# EAGLE design switch-rev2 (EAGLE 6.2)
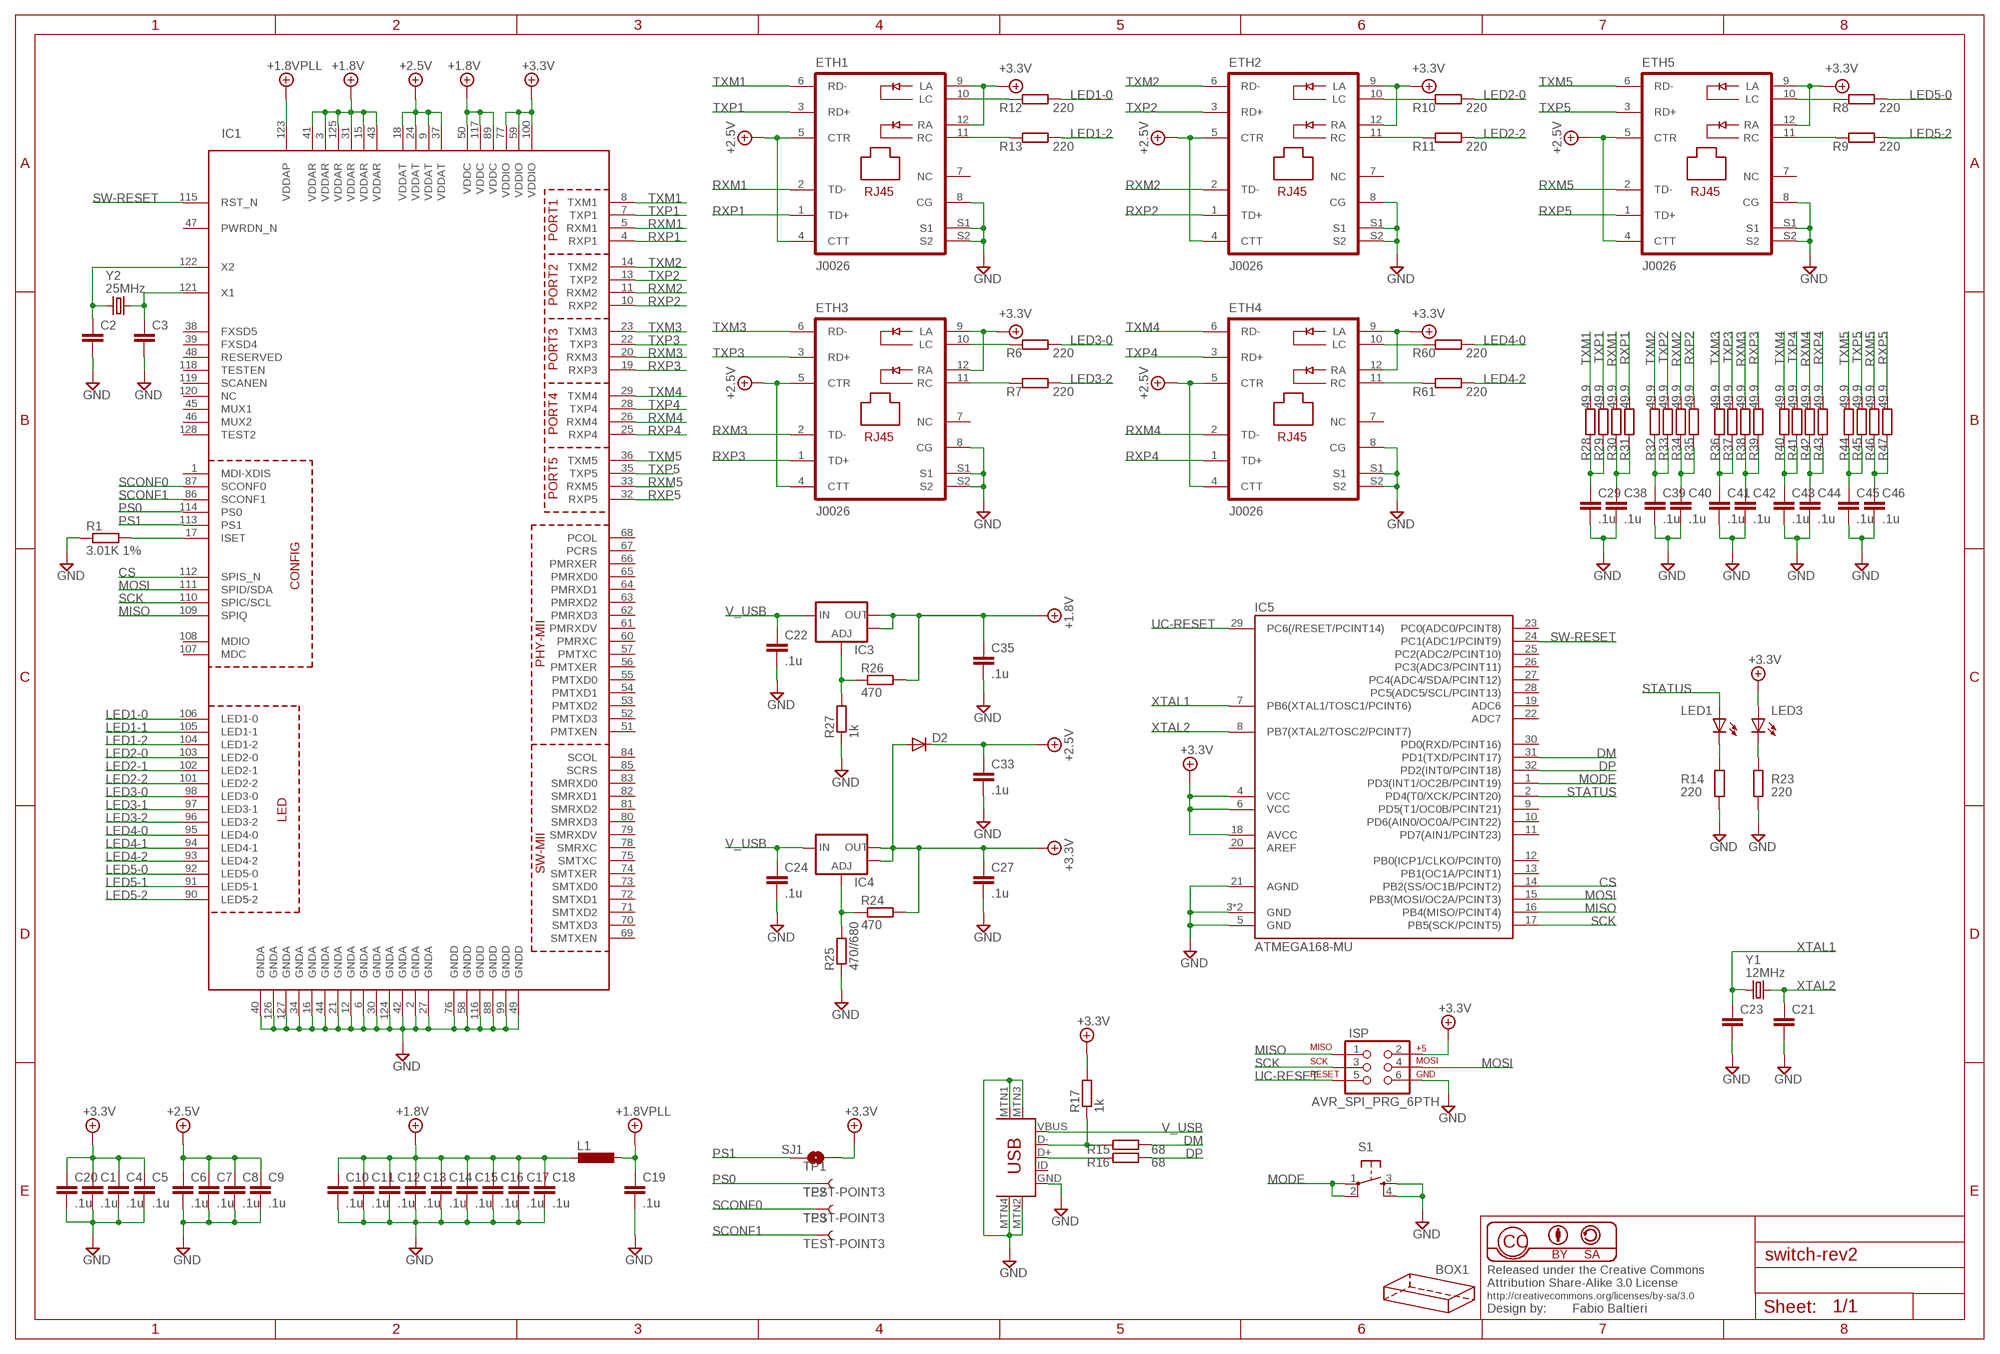
[diagram p0: schematic, sheet 1]

## Parts
BOX1  HAMMOND-BOX-XXA  [1591XXA]
C1  .1u  C-EUC0805  [C0805]
C2  C-EUC0805  [C0805]
C3  C-EUC0805  [C0805]
C4  .1u  C-EUC0805  [C0805]
C5  .1u  C-EUC0805  [C0805]
C6  .1u  C-EUC0805  [C0805]
C7  .1u  C-EUC0805  [C0805]
C8  .1u  C-EUC0805  [C0805]
C9  .1u  C-EUC0805  [C0805]
C10  .1u  C-EUC0805  [C0805]
C11  .1u  C-EUC0805  [C0805]
C12  .1u  C-EUC0805  [C0805]
C13  .1u  C-EUC0805  [C0805]
C14  .1u  C-EUC0805  [C0805]
C15  .1u  C-EUC0805  [C0805]
C16  .1u  C-EUC0805  [C0805]
C17  .1u  C-EUC0805  [C0805]
C18  .1u  C-EUC0805  [C0805]
C19  .1u  C-EUC0805  [C0805]
C20  .1u  C-EUC0805  [C0805]
C21  C-EUC0805  [C0805]
C22  .1u  C-EUC0805  [C0805]
C23  C-EUC0805  [C0805]
C24  .1u  C-EUC0805  [C0805]
C27  .1u  C-EUC0805  [C0805]
C29  .1u  C-EUC0805  [C0805]
C33  .1u  C-EUC0805  [C0805]
C35  .1u  C-EUC0805  [C0805]
C38  .1u  C-EUC0805  [C0805]
C39  .1u  C-EUC0805  [C0805]
C40  .1u  C-EUC0805  [C0805]
C41  .1u  C-EUC0805  [C0805]
C42  .1u  C-EUC0805  [C0805]
C43  .1u  C-EUC0805  [C0805]
C44  .1u  C-EUC0805  [C0805]
C45  .1u  C-EUC0805  [C0805]
C46  .1u  C-EUC0805  [C0805]
D2  DIODE-SMB  [SMB]
ETH1  J0026  [PJ-J0]
ETH2  J0026  [PJ-J0]
ETH3  J0026  [PJ-J0]
ETH4  J0026  [PJ-J0]
ETH5  J0026  [PJ-J0]
IC1  KS8995MA  [PQFP128L]
IC3  V_REG_LM1117SOT223  [SOT223]
IC4  V_REG_LM1117SOT223  [SOT223]
IC5  ATMEGA168-MU  [MLF32-TH]
ISP  AVR_SPI_PRG_6PTH  [2X3]
L1  L-EUL2012C  [L2012C]
LED1  LEDCHIPLED_0603  [CHIPLED_0603]
LED3  LEDCHIPLED_0603  [CHIPLED_0603]
R1  3.01K 1%  R-EU_R0603  [R0603]
R6  220  R-EU_R0603  [R0603]
R7  220  R-EU_R0603  [R0603]
R8  220  R-EU_R0603  [R0603]
R9  220  R-EU_R0603  [R0603]
R10  220  R-EU_R0603  [R0603]
R11  220  R-EU_R0603  [R0603]
R12  220  R-EU_R0603  [R0603]
R13  220  R-EU_R0603  [R0603]
R14  220  R-EU_R0603  [R0603]
R15  68  R-EU_R0603  [R0603]
R16  68  R-EU_R0603  [R0603]
R17  1k  R-EU_R0603  [R0603]
R23  220  R-EU_R0603  [R0603]
R24  470  R-EU_R0603  [R0603]
R25  470//680  R-EU_R0603  [R0603]
R26  470  R-EU_R0603  [R0603]
R27  1k  R-EU_R0603  [R0603]
R28  49.9  R-EU_R0603  [R0603]
R29  49.9  R-EU_R0603  [R0603]
R30  49.9  R-EU_R0603  [R0603]
R31  49.9  R-EU_R0603  [R0603]
R32  49.9  R-EU_R0603  [R0603]
R33  49.9  R-EU_R0603  [R0603]
R34  49.9  R-EU_R0603  [R0603]
R35  49.9  R-EU_R0603  [R0603]
R36  49.9  R-EU_R0603  [R0603]
R37  49.9  R-EU_R0603  [R0603]
R38  49.9  R-EU_R0603  [R0603]
R39  49.9  R-EU_R0603  [R0603]
R40  49.9  R-EU_R0603  [R0603]
R41  49.9  R-EU_R0603  [R0603]
R42  49.9  R-EU_R0603  [R0603]
R43  49.9  R-EU_R0603  [R0603]
R44  49.9  R-EU_R0603  [R0603]
R45  49.9  R-EU_R0603  [R0603]
R46  49.9  R-EU_R0603  [R0603]
R47  49.9  R-EU_R0603  [R0603]
R60  220  R-EU_R0603  [R0603]
R61  220  R-EU_R0603  [R0603]
S1  TAC_SWITCHSMD  [TACTILE_SWITCH_SMD]
SJ1  SOLDERJUMPERTRACE  [SJ_2S-TRACE]
TP1  TEST-POINT3  [PAD.03X.03]
TP2  TEST-POINT3  [PAD.03X.03]
TP3  TEST-POINT3  [PAD.03X.03]
U$1  USB-MINIB-5PIN  [USB-MINIB]
Y1  12MHz  CRYSTAL5X3  [CRYSTAL-SMD-5X3]
Y2  25MHz  CRYSTAL5X3  [CRYSTAL-SMD-5X3]

## Nets
+5V [Power]: C1.1 C4.1 C5.1 C20.1 C27.1 D2.A ETH1.9(LA) ETH1.12(RA) ETH2.9(LA) ETH2.12(RA) ETH3.9(LA) ETH3.12(RA) ETH4.9(LA) ETH4.12(RA) ETH5.9(LA) ETH5.12(RA) IC1.59(VDDIO) IC1.77(VDDIO) IC1.100(VDDIO) IC4.2(OUT) IC4.4(OUT) IC5.4(VCC) IC5.6(VCC) IC5.18(AVCC) ISP.2 LED3.A R17.2 R24.2 SJ1.2 ; supply symbol labelled +3.3V
+5V/1 [Power]: C6.1 C7.1 C8.1 C9.1 C33.1 D2.C ETH1.4(CTT) ETH1.5(CTR) ETH2.4(CTT) ETH2.5(CTR) ETH3.4(CTT) ETH3.5(CTR) ETH4.4(CTT) ETH4.5(CTR) ETH5.4(CTT) ETH5.5(CTR) IC1.9(VDDAT) IC1.18(VDDAT) IC1.24(VDDAT) IC1.37(VDDAT) ; supply symbol labelled +2.5V
+5V/2 [Power]: C10.1 C11.1 C12.1 C13.1 C14.1 C15.1 C16.1 C17.1 C18.1 C35.1 IC1.3(VDDAR) IC1.15(VDDAR) IC1.31(VDDAR) IC1.41(VDDAR) IC1.43(VDDAR) IC1.50(VDDC) IC1.89(VDDC) IC1.117(VDDC) IC1.125(VDDAR) IC3.2(OUT) IC3.4(OUT) L1.2 R26.2 ; supply symbol labelled +1.8V
+5V/4: C19.1 IC1.123(VDDAP) L1.1 ; supply symbol labelled +1.8VPLL
CS: IC1.112(SPIS_N) IC5.14(PB2(SS/OC1B/PCINT2))
DM: IC5.31(PD1(TXD/PCINT17)) R15.1
DP: IC5.32(PD2(INT0/PCINT18)) R16.1
GND [Power]: C1.2 C2.2 C3.2 C4.2 C5.2 C6.2 C7.2 C8.2 C9.2 C10.2 C11.2 C12.2 C13.2 C14.2 C15.2 C16.2 C17.2 C18.2 C19.2 C20.2 C21.2 C22.2 C23.2 C24.2 C27.2 C29.2 C33.2 C35.2 C38.2 C39.2 C40.2 C41.2 C42.2 C43.2 C44.2 C45.2 C46.2 ETH1.8(CG) ETH1.S1 ETH1.S2 ETH2.8(CG) ETH2.S1 ETH2.S2 ETH3.8(CG) ETH3.S1 ETH3.S2 ETH4.8(CG) ETH4.S1 ETH4.S2 ETH5.8(CG) ETH5.S1 ETH5.S2 IC1.2(GNDA) IC1.6(GNDA) IC1.12(GNDA) IC1.16(GNDA) IC1.21(GNDA) IC1.27(GNDA) IC1.30(GNDA) IC1.34(GNDA) IC1.40(GNDA) IC1.42(GNDA) IC1.44(GNDA) IC1.49(GNDD) IC1.58(GNDD) IC1.76(GNDD) IC1.88(GNDD) IC1.99(GNDD) IC1.116(GNDD) IC1.124(GNDA) IC1.126(GNDA) IC1.127(GNDA) IC5.3(GND) IC5.5(GND) IC5.21(AGND) IC5.TH(GND) ISP.6 R1.1 R14.1 R23.1 R25.1 R27.1 S1.3 S1.4 U$1.GND U$1.MTN1(MTN2) U$1.MTN2(MTN3) U$1.MTN3(MTN1) U$1.MTN4
LED1-0: IC1.106(LED1-0) R12.1
LED1-1: IC1.105(LED1-1)
LED1-2: IC1.104(LED1-2) R13.1
LED2-0: IC1.103(LED2-0) R10.1
LED2-1: IC1.102(LED2-1)
LED2-2: IC1.101(LED2-2) R11.1
LED3-0: IC1.98(LED3-0) R6.1
LED3-1: IC1.97(LED3-1)
LED3-2: IC1.96(LED3-2) R7.1
LED4-0: IC1.95(LED4-0) R60.1
LED4-1: IC1.94(LED4-1)
LED4-2: IC1.93(LED4-2) R61.1
LED5-0: IC1.92(LED5-0) R8.1
LED5-1: IC1.91(LED5-1)
LED5-2: IC1.90(LED5-2) R9.1
MISO: IC1.109(SPIQ) IC5.16(PB4(MISO/PCINT4)) ISP.1
MODE: IC5.1(PD3(INT1/OC2B/PCINT19)) S1.1 S1.2
MOSI: IC1.111(SPID/SDA) IC5.15(PB3(MOSI/OC2A/PCINT3)) ISP.4
N$1: IC1.17(ISET) R1.2
N$2: C2.1 IC1.122(X2) Y2.1
N$4: C3.1 IC1.121(X1) Y2.3
N$5: ETH1.11(RC) R13.2
N$9: ETH3.10(LC) R6.2
N$10: ETH3.11(RC) R7.2
N$11: ETH5.10(LC) R8.2
N$12: ETH5.11(RC) R9.2
N$13: ETH2.10(LC) R10.2
N$14: ETH1.10(LC) R12.2
N$15: ETH2.11(RC) R11.2
N$16: LED1.C R14.2
N$17: R15.2 R17.1 U$1.D-
N$18: R16.2 U$1.D+
N$25: LED3.C R23.2
N$47: IC4.1(ADJ) R24.1 R25.2
N$48: IC3.1(ADJ) R26.1 R27.2
N$51: C29.1 R28.1 R29.1
N$53: C38.1 R30.1 R31.1
N$54: C39.1 R32.1 R33.1
N$55: C40.1 R34.1 R35.1
N$56: C41.1 R36.1 R37.1
N$57: C42.1 R38.1 R39.1
N$58: C43.1 R40.1 R41.1
N$59: C44.1 R42.1 R43.1
N$60: C45.1 R44.1 R45.1
N$61: C46.1 R46.1 R47.1
N$68: ETH4.10(LC) R60.2
N$69: ETH4.11(RC) R61.2
PS0: IC1.114(PS0) TP1.P$1
PS1: IC1.113(PS1) SJ1.1
RXM1: ETH1.2(TD-) IC1.5(RXM1) R30.2
RXM2: ETH2.2(TD-) IC1.11(RXM2) R34.2
RXM3: ETH3.2(TD-) IC1.20(RXM3) R38.2
RXM4: ETH4.2(TD-) IC1.26(RXM4) R42.2
RXM5: ETH5.2(TD-) IC1.33(RXM5) R46.2
RXP1: ETH1.1(TD+) IC1.4(RXP1) R31.2
RXP2: ETH2.1(TD+) IC1.10(RXP2) R35.2
RXP3: ETH3.1(TD+) IC1.19(RXP3) R39.2
RXP4: ETH4.1(TD+) IC1.25(RXP4) R43.2
RXP5: ETH5.1(TD+) IC1.32(RXP5) R47.2
SCK: IC1.110(SPIC/SCL) IC5.17(PB5(SCK/PCINT5)) ISP.3
SCONF0: IC1.87(SCONF0) TP2.P$1
SCONF1: IC1.86(SCONF1) TP3.P$1
STATUS: IC5.2(PD4(T0/XCK/PCINT20)) LED1.A
SW-RESET: IC1.115(RST_N) IC5.24(PC1(ADC1/PCINT9))
TXM1: ETH1.6(RD-) IC1.8(TXM1) R28.2
TXM2: ETH2.6(RD-) IC1.14(TXM2) R32.2
TXM3: ETH3.6(RD-) IC1.23(TXM3) R36.2
TXM4: ETH4.6(RD-) IC1.29(TXM4) R40.2
TXM5: ETH5.6(RD-) IC1.36(TXM5) R44.2
TXP1: ETH1.3(RD+) IC1.7(TXP1) R29.2
TXP2: ETH2.3(RD+) IC1.13(TXP2) R33.2
TXP3: ETH3.3(RD+) IC1.22(TXP3) R37.2
TXP4: ETH4.3(RD+) IC1.28(TXP4) R41.2
TXP5: ETH5.3(RD+) IC1.35(TXP5) R45.2
UC-RESET: IC5.29(PC6(/RESET/PCINT14)) ISP.5
V_USB: C22.1 C24.1 IC3.3(IN) IC4.3(IN) U$1.VBUS
XTAL1: C23.1 IC5.7(PB6(XTAL1/TOSC1/PCINT6)) Y1.1
XTAL2: C21.1 IC5.8(PB7(XTAL2/TOSC2/PCINT7)) Y1.3
Unconnected: ETH1.7(NC) ETH2.7(NC) ETH3.7(NC) ETH4.7(NC) ETH5.7(NC) IC1.1(MDI-XDIS) IC1.38(FXSD5) IC1.39(FXSD4) IC1.45(MUX1) IC1.46(MUX2) IC1.47(PWRDN_N) IC1.48(RESERVED) IC1.51(PMTXEN) IC1.52(PMTXD3) IC1.53(PMTXD2) IC1.54(PMTXD1) IC1.55(PMTXD0) IC1.56(PMTXER) IC1.57(PMTXC) IC1.60(PMRXC) IC1.61(PMRXDV) IC1.62(PMRXD3) IC1.63(PMRXD2) IC1.64(PMRXD1) IC1.65(PMRXD0) IC1.66(PMRXER) IC1.67(PCRS) IC1.68(PCOL) IC1.69(SMTXEN) IC1.70(SMTXD3) IC1.71(SMTXD2) IC1.72(SMTXD1) IC1.73(SMTXD0) IC1.74(SMTXER) IC1.75(SMTXC) IC1.78(SMRXC) IC1.79(SMRXDV) IC1.80(SMRXD3) IC1.81(SMRXD2) IC1.82(SMRXD1) IC1.83(SMRXD0) IC1.84(SCOL) IC1.85(SCRS) IC1.107(MDC) IC1.108(MDIO) IC1.118(TESTEN) IC1.119(SCANEN) IC1.120(NC) IC1.128(TEST2) IC5.9(PD5(T1/OC0B/PCINT21)) IC5.10(PD6(AIN0/OC0A/PCINT22)) IC5.11(PD7(AIN1/PCINT23)) IC5.12(PB0(ICP1/CLKO/PCINT0)) IC5.13(PB1(OC1A/PCINT1)) IC5.19(ADC6) IC5.20(AREF) IC5.22(ADC7) IC5.23(PC0(ADC0/PCINT8)) IC5.25(PC2(ADC2/PCINT10)) IC5.26(PC3(ADC3/PCINT11)) IC5.27(PC4(ADC4/SDA/PCINT12)) IC5.28(PC5(ADC5/SCL/PCINT13)) IC5.30(PD0(RXD/PCINT16)) U$1.ID

## Library data of the parts
BOX1 = hammond:HAMMOND-BOX: Hammond Project boxes Hammond 1551 Transluscent Blue 50x35x20mm 1551GTBU http://www.hammondmfg.com/pdf/1551G.pdf Hammond 1551 Transluscent Blue 50x50x20mm 1551RTBU http://www.hammondmfg.com/pdf/1551R.pdf Hammond 1551 Transluscent Blue 60x35x20mm 1551HTBU http://www.hammondmfg.com/pdf/1551H.pdf Hammond 1551 Transluscent Blue 80x40x20mm 1551KTBU http://www.hammondmfg.com/pdf/1551K.pdf Hammond 1591 Transluscent Blue 100x51x22m m 1591XXATBU http://www.hammondmfg.com/pdf/1591XXA.pdf
C1-C24 C27 C29 C33 C35 C38-C46 = rcl:C-EU: CAPACITOR, European symbol
D2 = diode:DIODE-: DIODE
ETH1-ETH5 = micrel:J0026: RJ45 PulseJack w/LEDs
IC1 = micrel:KS8995MA: 5 Port Managed Ethernet Switch
IC3 IC4 = SparkFun-PowerIC:V_REG_LM1117: Voltage Regulator LM1117 Standard adjustable voltage regulator but in SMD form. Spark Fun Electronics SKU : COM-00595
IC5 = balto:ATMEGA168
ISP = SparkFun:AVR_SPI_PRG_6: AVR ISP 6 Pin This is the reduced ISP connector for AVR programming. Common on Arduino. This footprint will take up less PCB space and can be used with a 10-pin to 6-pin adapter such as SKU: BOB-08508
L1 = rcl:L-EU: INDUCTOR, European symbol
LED1 LED3 = led:LED: LED OSRAM: - CHIPLED LG R971, LG N971, LY N971, LG Q971, LY Q971, LO R971, LY R971 LH N974, LH R974 LS Q976, LO Q976, LY Q976 LO Q996 - Hyper CHIPLED LW Q18S LB Q993, LB Q99A, LB R99A - SideLED LS A670, LO A670, LY A670, LG A670, LP A670 LB A673, LV A673, LT A673, LW A673 LH A674 LY A675 LS A676, LA A676, LO A676, LY A676, LW A676 LS A679, LY A679, LG A679 - Hyper Micro SIDELED® LS Y876, LA Y876, LO Y876, LY Y876 LT Y87S - SmartLED LW L88C, LW L88S LB L89C, LB L89S, LG L890 LS L89K, LO L89K, LY L89K LS L896, LA L896, LO L896, LY L896 - TOPLED LS T670, LO T670, LY T670, LG T670, LP T670 LSG T670, LSP T670, LSY T670, LOP T670, LYG T670 LG T671, LOG T671, LSG T671 LB T673, LV T673, LT T673, LW T673 LH T674 LS T676, LA T676, LO T676, LY T676, LB T676, LH T676, LSB T676, LW T676 LB T67C, LV T67C, LT T67C, LS T67K, LO T67K, LY T67K, LW E67C LS E67B, LA E67B, LO E67B, LY E67B, LB E67C, LV E67C, LT E67C LW T67C LS T679, LY T679, LG T679 LS T770, LO T770, LY T770, LG T770, LP T770 LB T773, LV T773, LT T773, LW T773 LH T774 LS E675, LA E675, LY E675, LS T675 LS T776, LA T776, LO T776, LY T776, LB T776 LHGB T686 LT T68C, LB T68C - Hyper Mini TOPLED® LB M676 - Mini TOPLED Santana® LG M470 LS M47K, LO M47K, LY M47K Source: http://www.osram.convergy.de LUXEON: - LUMILED® LXK2-PW12-R00, LXK2-PW12-S00, LXK2-PW14-U00, LXK2-PW14-V00 LXK2-PM12-R00, LXK2-PM12-S00, LXK2-PM14-U00 LXK2-PE12-Q00, LXK2-PE12-R00, LXK2-PE12-S00, LXK2-PE14-T00, LXK2-PE14-U00 LXK2-PB12-K00, LXK2-PB12-L00, LXK2-PB12-M00, LXK2-PB14-N00, LXK2-PB14-P00, LXK2-PB14-Q00 LXK2-PR12-L00, LXK2-PR12-M00, LXK2-PR14-Q00, LXK2-PR14-R00 LXK2-PD12-Q00, LXK2-PD12-R00, LXK2-PD12-S00 LXK2-PH12-R00, LXK2-PH12-S00 LXK2-PL12-P00, LXK2-PL12-Q00, LXK2-PL12-R00 Source: www.luxeon.com KINGBRIGHT: KA-3528ASYC Source: www.kingbright.com
R1 R6-R17 R23-R47 R60 R61 = rcl:R-EU_: RESISTOR, European symbol
S1 = SparkFun:TAC_SWITCH: Momentary Switch Button commonly used for reset or general input. Spark Fun Electronics SKU : COM-00097
SJ1 = SparkFun-Passives:SOLDERJUMPER: Solder Jumper Standard SMD solder jumper. Used to automate production. Two varients : Normally Open and Normally Closed are the same, but have different paste layers. NC will have a large amount of paste and should jumper during reflow.
TP1-TP3 = SparkFun-Passives:TEST-POINT: Bare copper test points for troubleshooting or ICT
U$1 = SparkFun-Connectors:USB-MINIB: Mini-USB "B" connector with 5th pin broken out. Created new symbol breaking out 5th "ID" pin in mini/micro USB connector spec. See: http://en.wikipedia.org/wiki/Mini_usb#Cables. Uses same footprint as 4-pin symbol. Also added pins to connect to mounting / shield pads if required (probably not generally needed as signals aren't shielded once they leave the connector).
Y1 Y2 = SparkFun-FreqCtrl:CRYSTAL: Various standard crystals. Proven footprints. Spark Fun Electronics SKU : COM-00534

## Board
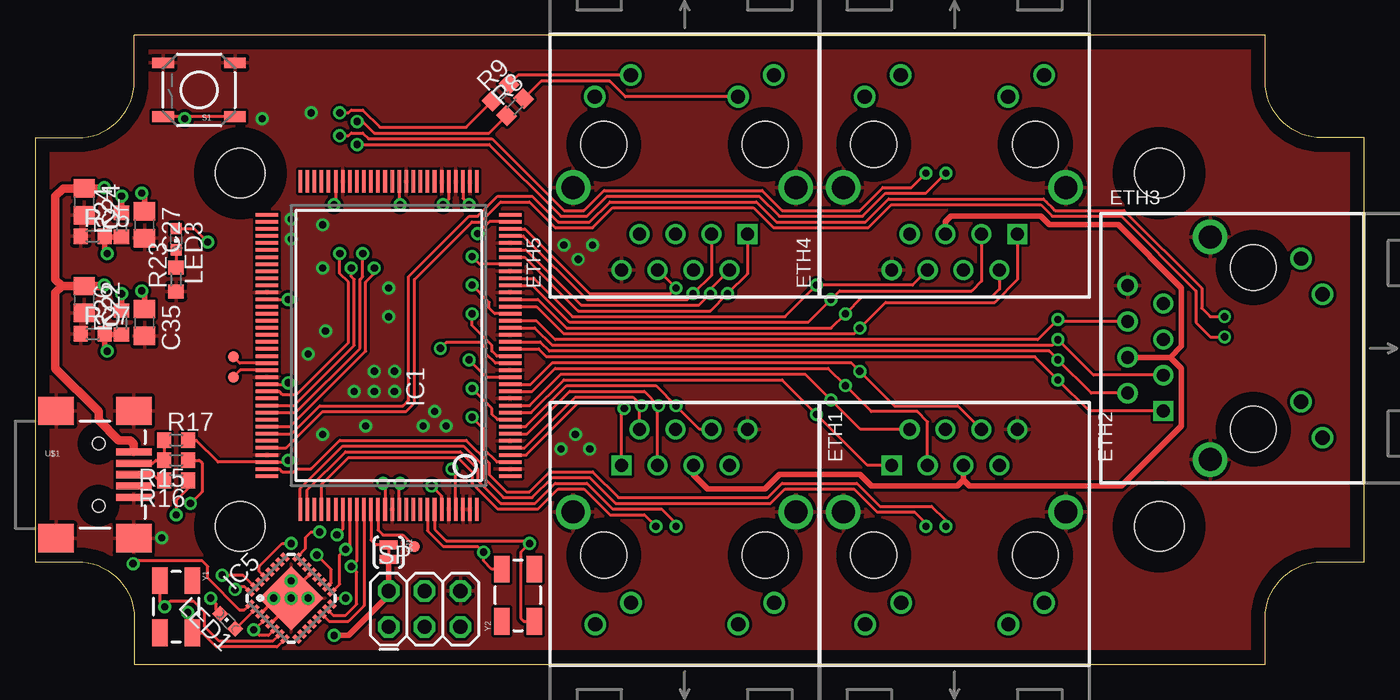
[diagram p1: board, top side]
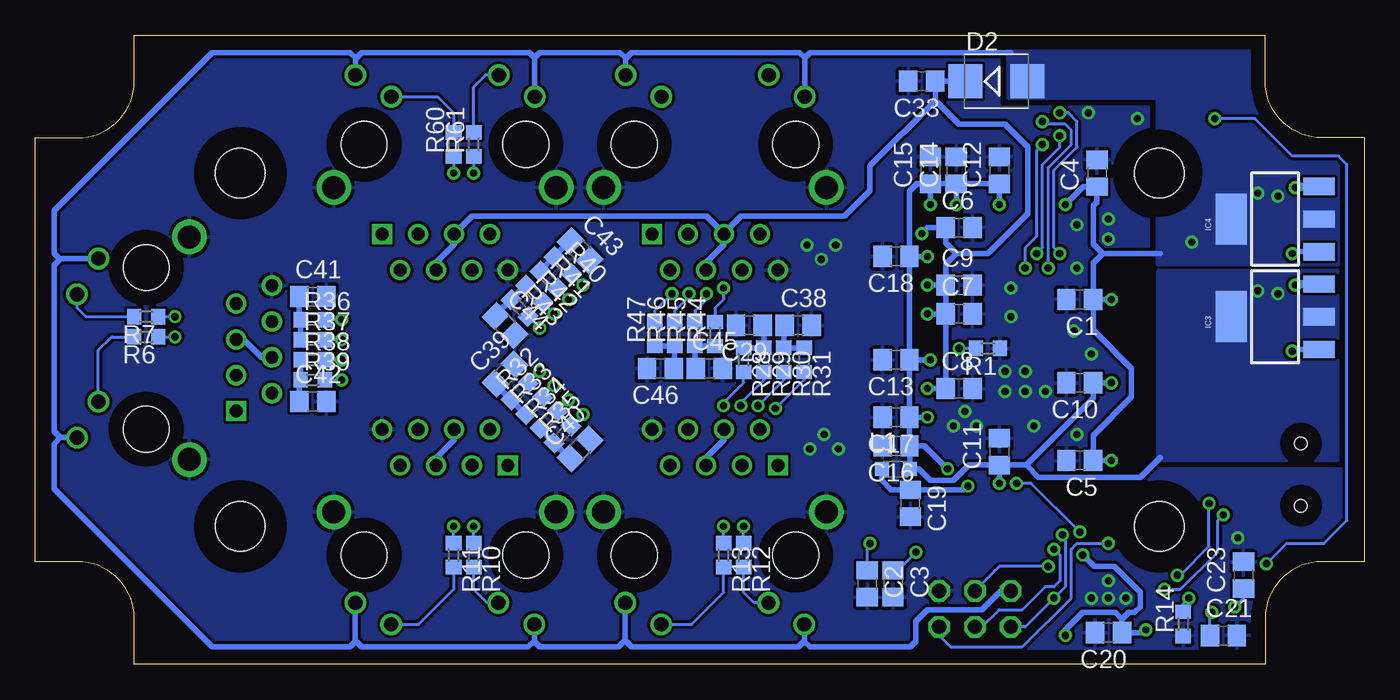
[diagram p2: board, bottom side, seen from below]

Size 94 x 44.5 mm. Coordinates in mm from the lower left corner, seen from the top.
Copper layers (1*16): Top 0.035mm / dielectric 1.5mm / Bottom 0.035mm
Design rules: minimum track width 8mil, minimum drill 20mil, track to track 8mil, track to pad 8mil, pad to pad 8mil, via to via 8mil, smd to smd 8mil, copper to edge 40mil, drill to drill 8mil, minimum pad ring 10mil, minimum via ring 8mil, stop-mask expansion 4mil, vias tented up to drill 24mil, thermal gap 10mil

### Footprints (pad centres in the part's own frame; a part is rotated, then mirrored left to right if it is on the bottom)
1591XXA = hole 3.5: 79.5,9.75; 14.5,34.75; 79.5,34.75; 14.5,9.75
C0805 = smd 1.3 x 1.5: 1 -0.95,0; 2 0.95,0
SMB = smd 2.4 x 2.4: A 2.2,0; C -2.2,0
PJ-J0 = drill 0.914 square: 1 4.445,-6.35 | drill 0.914: 2 3.175,-8.89; 3 1.905,-6.35; 4 0.635,-8.89; 5 -0.635,-6.35; 6 -1.905,-8.89; 7 -3.175,-6.35; 8 -4.445,-8.89 | drill 1.016: 9 6.325,4.902; 10 3.785,3.378; 11 -3.81,4.902; 12 -6.35,3.378 | drill 1.626: S1 -7.874,-3.048; S2 7.874,-3.048 | hole 3.251: -5.715,0; 5.715,0
PQFP128L = smd 0.25 x 1.6: 1 -9.25,-8.6; 2 -8.75,-8.6; 3 -8.25,-8.6; 4 -7.75,-8.6; 5 -7.25,-8.6; 6 -6.75,-8.6; 7 -6.25,-8.6; 8 -5.75,-8.6; 9 -5.25,-8.6; 10 -4.75,-8.6; 11 -4.25,-8.6; 12 -3.75,-8.6; 13 -3.25,-8.6; 14 -2.75,-8.6; 15 -2.25,-8.6; 16 -1.75,-8.6; 17 -1.25,-8.6; 18 -0.75,-8.6; 19 -0.25,-8.6; 20 0.25,-8.6; 21 0.75,-8.6; 22 1.25,-8.6; 23 1.75,-8.6; 24 2.25,-8.6; 25 2.75,-8.6; 26 3.25,-8.6; 27 3.75,-8.6; 28 4.25,-8.6; 29 4.75,-8.6; 30 5.25,-8.6; 31 5.75,-8.6; 32 6.25,-8.6; 33 6.75,-8.6; 34 7.25,-8.6; 35 7.75,-8.6; 36 8.25,-8.6; 37 8.75,-8.6; 38 9.25,-8.6; 65 9.25,8.6; 66 8.75,8.6; 67 8.25,8.6; 68 7.75,8.6; 69 7.25,8.6; 70 6.75,8.6; 71 6.25,8.6; 72 5.75,8.6; 73 5.25,8.6; 74 4.75,8.6; 75 4.25,8.6; 76 3.75,8.6; 77 3.25,8.6; 78 2.75,8.6; 79 2.25,8.6; 80 1.75,8.6; 81 1.25,8.6; 82 0.75,8.6; 83 0.25,8.6; 84 -0.25,8.6; 85 -0.75,8.6; 86 -1.25,8.6; 87 -1.75,8.6; 88 -2.25,8.6; 89 -2.75,8.6; 90 -3.25,8.6; 91 -3.75,8.6; 92 -4.25,8.6; 93 -4.75,8.6; 94 -5.25,8.6; 95 -5.75,8.6; 96 -6.25,8.6; 97 -6.75,8.6; 98 -7.25,8.6; 99 -7.75,8.6; 100 -8.25,8.6; 101 -8.75,8.6; 102 -9.25,8.6 | smd 1.6 x 0.25: 39 11.6,-6.25; 40 11.6,-5.75; 41 11.6,-5.25; 42 11.6,-4.75; 43 11.6,-4.25; 44 11.6,-3.75; 45 11.6,-3.25; 46 11.6,-2.75; 47 11.6,-2.25; 48 11.6,-1.75; 49 11.6,-1.25; 50 11.6,-0.75; 51 11.6,-0.25; 52 11.6,0.25; 53 11.6,0.75; 54 11.6,1.25; 55 11.6,1.75; 56 11.6,2.25; 57 11.6,2.75; 58 11.6,3.25; 59 11.6,3.75; 60 11.6,4.25; 61 11.6,4.75; 62 11.6,5.25; 63 11.6,5.75; 64 11.6,6.25; 103 -11.6,6.25; 104 -11.6,5.75; 105 -11.6,5.25; 106 -11.6,4.75; 107 -11.6,4.25; 108 -11.6,3.75; 109 -11.6,3.25; 110 -11.6,2.75; 111 -11.6,2.25; 112 -11.6,1.75; 113 -11.6,1.25; 114 -11.6,0.75; 115 -11.6,0.25; 116 -11.6,-0.25; 117 -11.6,-0.75; 118 -11.6,-1.25; 119 -11.6,-1.75; 120 -11.6,-2.25; 121 -11.6,-2.75; 122 -11.6,-3.25; 123 -11.6,-3.75; 124 -11.6,-4.25; 125 -11.6,-4.75; 126 -11.6,-5.25; 127 -11.6,-5.75; 128 -11.6,-6.25
SOT223 = smd 1.219 x 2.235: 1 -2.311,-3.099; 2 0,-3.099; 3 2.311,-3.099 | smd 3.6 x 2.2: 4 0,3.099
MLF32-TH = smd 0.65 x 0.29: 1 -2.35,1.75; 2 -2.35,1.25; 3 -2.35,0.75; 4 -2.35,0.25; 5 -2.35,-0.25; 6 -2.35,-0.75; 7 -2.35,-1.25; 8 -2.35,-1.75; 17 2.35,-1.75; 18 2.35,-1.25; 19 2.35,-0.75; 20 2.35,-0.25; 21 2.35,0.25; 22 2.35,0.75; 23 2.35,1.25; 24 2.35,1.75 | smd 0.29 x 0.65: 9 -1.75,-2.35; 10 -1.25,-2.35; 11 -0.75,-2.35; 12 -0.25,-2.35; 13 0.25,-2.35; 14 0.75,-2.35; 15 1.25,-2.35; 16 1.75,-2.35; 25 1.75,2.35; 26 1.25,2.35; 27 0.75,2.35; 28 0.25,2.35; 29 -0.25,2.35; 30 -0.75,2.35; 31 -1.25,2.35; 32 -1.75,2.35 | smd 3.2 x 3.2: TH 0,0
2X3 = drill 1.016 octagon: 1 0,0; 2 0,2.54; 3 2.54,0; 4 2.54,2.54; 5 5.08,0; 6 5.08,2.54
L2012C = smd 1 x 1: 1 -1,0; 2 1,0
CHIPLED_0603 = smd 0.8 x 0.8: A 0,-0.75; C 0,0.75
R0603 = smd 1 x 1.1: 1 -0.85,0; 2 0.85,0
TACTILE_SWITCH_SMD = smd 1.524 x 0.762: 1 -2.54,1.905; 2 2.54,1.905; 3 -2.54,-1.905; 4 2.54,-1.905
SJ_2S-TRACE = smd 0.635 x 1.27: 1 -0.508,0; 2 0.508,0
PAD.03X.03 = smd 0.762 x 0.762: P$1 0,0
USB-MINIB = smd 2.5 x 0.5: D+ 2.5,0; D- 2.5,0.8; GND 2.5,-1.6; ID 2.5,-0.8; VBUS 2.5,1.6 | smd 2.5 x 2: MTN1 -3,4.5; MTN2 2.5,4.5; MTN3 -3,-4.5; MTN4 2.5,-4.5 | hole 0.9: 0,2.2; 0,-2.2
CRYSTAL-SMD-5X3 = smd 1.9 x 1.1: 1 -1.85,-1.15; 2 1.85,-1.15; 3 1.85,1.15; 4 -1.85,1.15

### Placement (x,y rotation side)
BOX1  0,0 0 top
C1  20.12,25.81 180 bottom
C2  35.15,5.69 270 bottom
C3  33.32,5.69 270 bottom
C4  18.9,34.75 90 bottom
C5  20.12,14.43 180 bottom
C6  28.65,30.89 0 bottom
C7  28.65,24.79 0 bottom
C8  28.65,19.51 0 bottom
C9  28.65,26.82 0 bottom
C10  20.12,19.91 180 bottom
C11  25.81,15.04 90 bottom
C12  25.81,34.95 90 bottom
C13  33.12,21.54 180 bottom
C14  28.85,34.95 90 bottom
C15  30.68,34.95 90 bottom
C16  33.12,15.44 180 bottom
C17  33.12,17.48 180 bottom
C18  33.12,28.85 180 bottom
C19  32.11,11.38 270 bottom
C20  18.08,2.24 180 bottom
C21  9.96,2.03 0 bottom
C22  3.45,25.81 270 top
C23  8.53,6.3 90 bottom
C24  3.45,32.72 270 top
C27  7.72,31.09 270 top
C29  43.48,23.98 180 bottom
C33  31.29,41.25 180 bottom
C35  7.72,24.18 270 top
C38  40.03,23.98 0 bottom
C39  60.76,20.52 45 bottom
C40  55.47,15.24 45 bottom
C41  74.37,26.01 0 bottom
C42  74.37,18.59 0 bottom
C43  55.47,29.26 315 bottom
C44  60.76,23.98 315 bottom
C45  46.33,20.93 0 bottom
C46  49.78,20.93 180 bottom
D2  26.01,41.25 0 bottom
ETH1  45.92,7.72 180 top
ETH2  65.02,7.72 180 top
ETH3  86.16,22.35 270 top
ETH4  65.02,36.78 0 top
ETH5  45.92,36.78 0 top
IC1  24.99,22.56 90 top
IC3  6.3,24.59 90 bottom
IC4  6.3,31.5 90 bottom
IC5  18.08,4.67 45 top
ISP  24.99,2.64 0 top
L1  33.12,13.82 0 bottom
LED1  13.61,3.05 45 top
LED3  9.96,30.07 180 top
R1  26.62,22.35 180 bottom
R6  86.16,23.16 180 bottom
R7  86.16,24.59 180 bottom
R8  33.93,39.42 45 top
R9  32.92,40.44 45 top
R10  62.99,7.72 270 bottom
R11  64.41,7.72 270 bottom
R12  43.89,7.72 270 bottom
R13  45.31,7.72 270 bottom
R14  12.8,2.84 90 bottom
R15  9.96,14.43 180 top
R16  9.96,13 180 top
R17  9.96,15.85 0 top
R23  9.96,27.23 90 top
R24  6.1,31.09 90 top
R25  4.06,30.28 0 top
R26  6.1,24.18 90 top
R27  4.06,23.37 0 top
R28  43.89,21.54 270 bottom
R29  42.47,21.54 270 bottom
R30  41.05,21.54 270 bottom
R31  39.62,21.54 270 bottom
R32  59.74,19.3 45 bottom
R33  58.72,18.29 45 bottom
R34  57.71,17.27 45 bottom
R35  56.69,16.26 45 bottom
R36  74.37,24.38 0 bottom
R37  74.37,22.96 0 bottom
R38  74.37,21.54 0 bottom
R39  74.37,20.12 0 bottom
R40  56.69,28.24 315 bottom
R41  57.71,27.23 315 bottom
R42  58.72,26.21 315 bottom
R43  59.74,25.2 315 bottom
R44  45.92,23.37 90 bottom
R45  47.35,23.37 90 bottom
R46  48.77,23.37 90 bottom
R47  50.19,23.37 90 bottom
R60  64.41,36.78 90 bottom
R61  62.99,36.78 90 bottom
S1  11.58,40.64 180 top
SJ1  24.99,7.92 270 top
TP1  26.82,8.33 180 top
TP2  14.02,20.32 180 top
TP3  14.02,21.74 180 top
U$1  4.47,13.41 0 top
Y1  9.96,4.06 270 top
Y2  34.14,4.88 90 top

### Tracks (layer width: path | path; a pad name or v marks a point on that pad's centre or on a via)
+5V  (via drill 0.51)
  Top 0.203: IC5.6 16.5,2.03 15.85,2.03 v15.44,2.44 15.5,2.44 IC5.4 | IC5.18 20.93,5.75 20.93,6.71 v19.91,7.72 | IC1.59 21.24,32.62 v21.13,32.51 | IC1.77 v17.88,25.8 v17.88,25.81 | v17.88,14.43 17.76,14.3 IC1.100 12.92,14.3 11.38,15.85 R17.2 | LED3.A 11.24,30.82 v12.19,29.87
  Top 0.406: R24.2 v6.1,33.12 | C27.1 7.72,33.12 v7.52,33.33 | SJ1.2 ISP.2 24.99,4.88 22.15,2.03 v21.13,2.03
  Bottom 0.203: v12.19,29.87 12.39,29.87
  Bottom 0.406: C1.1 v17.88,25.81 | v17.88,14.43 C5.1 19.17,16.19 16.46,18.9 16.46,20.93 19.17,23.64 C1.1 | C1.1 19.17,28.38 18.49,29.06 | 18.49,29.06 19.17,29.73 19.17,32.45 18.9,32.72 C4.1 19.85,33.8 v21.13,32.51 | 18.49,29.06 14.43,29.06 | ETH5.12 39.57,42.93 | 39.57,42.93 39.22,43.28 24.99,43.28 | 39.57,42.93 39.93,43.28 51.82,43.28 52.25,42.85 | ETH5.9 52.25,42.85 | 52.25,42.85 52.25,42.9 52.63,43.28 58.32,43.28 58.67,42.93 | ETH4.12 58.67,42.93 | 58.67,42.93 59.03,43.28 70.92,43.28 71.32,42.88 | ETH4.9 71.35,42.85 71.32,42.88 | 71.32,42.88 71.73,43.28 81.48,43.28 92.66,32.11 92.66,29.06 92.3,28.7 | ETH3.12 92.3,28.7 | 92.3,28.7 92.3,28.6 92.66,28.25 92.66,16.46 92.23,16.03 | ETH3.9 92.23,16.03 | 92.23,16.03 92.66,15.6 92.66,12.39 81.48,1.22 71.73,1.22 71.37,1.57 | ETH2.12 71.37,1.57 | 71.37,1.57 71.27,1.57 70.92,1.22 59.13,1.22 58.73,1.63 | ETH2.9 58.7,1.65 58.73,1.63 | 58.73,1.63 58.32,1.22 52.73,1.22 52.27,1.68 | ETH1.9 39.6,1.65 | 39.6,1.65 40.03,1.22 51.82,1.22 52.27,1.68 | 39.6,1.65 39.6,1.6 39.22,1.22 32.11,1.22 31.7,1.63 31.7,3.05 30.89,3.86 27.03,3.86 25.7,5.18 ISP.2 | ETH1.12 52.27,1.68 | v19.91,7.72 19.1,6.91 17.68,6.91 15.85,5.08 15.85,4.06 16.26,3.66 16.66,3.66 17.14,3.19 | 17.14,3.19 C20.1 15.65,2.23 v15.44,2.44 | v21.13,2.03 21.13,2.44 19.91,3.66 17.61,3.66 17.14,3.19
  pour Bottom (no thermals): 1.83,28.24 14.63,28.24 14.63,40.03 25.2,40.03 25.2,44.91 1.83,44.91
+5V/1  (via drill 0.51)
  Top 0.203: IC1.9 32.68,17.3 32.31,17.68 32.31,18.09 v30.89,19.51 | IC1.18 32.65,21.8 32.31,22.15 32.31,22.55 30.89,23.98 v30.89,24.79 | IC1.24 32.5,24.8 32.11,25.2 32.11,25.6 v30.89,26.82 | IC1.37 32.12,31.3 v31.29,30.48
  Top 0.406: ETH4.5 64.39,31.32 64.77,31.7 71.12,31.7 71.73,31.09 76.61,31.09 81.08,26.62 81.08,22.5 80.29,21.72 | ETH1.5 46.56,13.39 47.55,12.39 51.61,12.39 52.63,13.41 58.32,13.41 59.13,12.6 65.23,12.6 65.66,13.03 | ETH2.5 65.66,13.03 | ETH3.4 80.29,21.72 | 80.29,21.72 81.08,20.93 81.08,16.87 76.81,12.6 66.09,12.6 65.66,13.03
  Bottom 0.406: ETH1.5 46.56,14.61 45.29,15.88 ETH1.4 | ETH5.5 45.29,29.69 46.56,28.42 ETH5.4 | ETH4.4 65.66,28.42 64.39,29.69 ETH4.5 63.12,31.7 46.53,31.7 45.29,30.45 ETH5.5 | ETH2.4 64.39,15.88 65.66,14.61 ETH2.5 | ETH3.4 78,21.72 79.27,22.99 ETH3.5 | v30.89,19.51 C8.1 C7.1 | C7.1 v30.89,24.79 | C9.1 v30.89,26.82 | v31.29,30.48 30.89,30.89 C6.1 29.6,29.8 28.85,29.06 | C7.1 C9.1 | D2.C C33.1 30.34,39.89 | 30.34,39.89 28.65,38.2 25.4,38.2 23.77,36.58 23.77,31.9 26.62,29.06 28.85,29.06 | C9.1 29.6,28.31 28.85,29.06 | 30.34,39.89 34.95,35.29 34.95,33.53 36.78,31.7 44.09,31.7 45.29,30.5 ETH5.5
+5V/2  (via drill 0.51)
  Top 0.203: IC1.3 32.65,14.3 31.71,15.24 31.71,16.65 v30.89,17.48 | IC1.15 31.92,20.3 v30.68,21.54 | IC1.31 31.44,28.3 v30.89,28.85 | IC1.50 25.74,32.58 v25.81,32.51 | IC1.43 29.24,32.9 v28.85,32.51 | IC1.41 30.24,32.95 v30.68,32.51 | IC1.117 25.74,12.74 v25.81,12.8 | IC1.89 17.77,19.8 v17.88,19.91 | IC1.125 29.74,13.54 v29.46,13.82
  Top 0.406: R26.2 v6.1,26.21 | C35.1 7.72,26.21 v7.52,26.42
  Bottom 0.406: C16.1 C17.1 | C17.1 C13.1 | C13.1 C18.1 | v30.89,28.85 C18.1 | v30.68,21.54 C13.1 | v30.89,17.48 C17.1 | C11.1 v25.81,12.8 | C16.1 32.17,15.36 | C16.1 32.12,15.39 L1.2 31.5,13.82 30.68,13.01 29.06,13.01 27.98,14.09 C11.1 | v17.88,19.91 C10.1 19.17,18.83 23.91,14.09 | C18.1 32.17,33.46 31.63,34 C15.1 | C15.1 C14.1 | C14.1 C12.1 v25.81,32.51 | C14.1 v28.85,32.51 | C15.1 v30.68,32.51 | C11.1 23.91,14.09 | 23.91,14.09 23.03,13.21 15.85,13.21 14.43,14.63 | C16.1 31.09,15.44 v29.46,13.82
  pour Bottom (no thermals): 1.83,14.43 1.83,27.84 14.63,27.84 14.63,14.43
+5V/4  (via drill 0.51)
  Top 0.203: IC1.123 28.74,11.9 v28.04,12.6
  Bottom 0.406: L1.1 34.12,12.99 33.46,12.33 C19.1 28.31,12.33 v28.04,12.6
CS
  Top 0.203: IC5.14 20.77,3.05 22.15,3.05 23.24,4.14 IC1.112
DM  (via drill 0.51)
  Top 0.203: IC5.31 14.69,6.3 v13.21,6.3 | R15.1 11.58,14.43 11.79,14.22 11.79,12.19 v10.97,11.38
  Bottom 0.203: v13.21,6.3 13.01,6.3 10.97,8.33 v10.97,11.38
DP  (via drill 0.51)
  Top 0.203: IC5.32 14.8,5.49 14.33,5.49 v14.12,5.28 | R16.1 10.81,12.43 9.96,11.58 v9.96,10.57
  Bottom 0.203: v14.12,5.28 13.01,5.28 10.36,7.92 10.36,10.16 v9.96,10.57
GND  (via drill 0.51)
  Top 0.254: IC5.3 16.87,4.51 v16.87,4.67 | IC5.5 18.09,4.32 IC5.TH | IC5.21 18.95,5.89 v18.09,5.89
  other vias: 20.32,16.26 18.08,4.67 19.3,4.67 8.94,8.94 29.06,16.87 28.24,17.88 27.43,16.87 23.37,16.87 23.98,19.3 25.4,19.3 25.4,20.73 22.56,19.3 23.98,20.73 20.32,31.09 20.32,28.04 16.05,38.61 19.51,39.01 24.99,26.62 24.99,24.59 18.08,31.5 18.08,30.07 37.19,15.24 38.2,16.26 39.22,15.24 38.4,28.65 37.39,29.67 39.42,29.67 19.3,21.95 20.52,23.57
  pour Bottom (isolate 0.203): 25.81,44.91 94.49,44.91 94.49,-0.41 -0.41,-0.41 -0.41,13.82 15.24,13.82 15.24,39.42 25.81,39.42
  pour Top (isolate 0.203): -0.2,44.7 94.28,44.7 94.34,-0.25 -0.2,-0.2
LED1-0  (via drill 0.51)
  Top 0.203: IC1.106 20.24,12.72 22.15,14.63 29.87,14.63 30.89,13.61 30.89,12.8 32.72,10.97 35.56,10.97 36.98,12.39 38.81,12.39 40.64,10.57 43.08,10.57 v43.89,9.75
  Bottom 0.203: R12.1 v43.89,9.75
LED1-2  (via drill 0.51)
  Top 0.203: IC1.104 19.24,12.34 21.95,15.04 30.07,15.04 31.29,13.82 31.29,13.01 32.92,11.38 35.36,11.38 36.78,12.8 39.01,12.8 40.84,10.97 44.3,10.97 45.31,9.96 v45.31,9.75
  Bottom 0.203: R13.1 v45.31,9.75
LED2-0  (via drill 0.51)
  Top 0.203: IC1.103 18.74,12.44 21.74,15.44 30.28,15.44 31.7,14.02 31.7,13.21 33.12,11.79 35.15,11.79 36.58,13.21 39.22,13.21 41.05,11.38 52.02,11.38 53.03,12.39 57.91,12.39 59.54,10.77 62.18,10.77 62.99,9.96 v62.99,9.75
  Bottom 0.203: R10.1 v62.99,9.75
LED2-2  (via drill 0.51)
  Top 0.203: IC1.101 17.28,13.8 17.48,13.61 18.29,13.61 18.49,13.82 19.51,13.82 21.54,15.85 30.48,15.85 32.11,14.22 32.11,13.41 33.33,12.19 34.95,12.19 36.37,13.61 39.42,13.61 41.25,11.79 51.82,11.79 52.83,12.8 58.12,12.8 59.74,11.18 63.4,11.18 64.41,10.16 v64.41,9.75
  Bottom 0.203: R11.1 v64.41,9.75
LED3-0  (via drill 0.51)
  Top 0.203: IC1.98 17.74,15.3 20.32,17.88 26.21,17.88 26.82,18.49 26.82,27.23 30.89,31.29 31.5,31.29 32.92,32.72 34.95,32.72 36.78,30.89 39.42,30.89 40.84,32.31 50.8,32.31 52.22,30.89 58.93,30.89 60.55,32.51 71.12,32.51 71.93,31.7 76.81,31.7 82.09,26.42 82.09,24.18 83.11,23.16 v84.12,23.16
  Bottom 0.203: R6.1 v84.12,23.16
LED3-2  (via drill 0.51)
  Top 0.203: IC1.96 18.13,16.3 20.12,18.29 26.01,18.29 26.42,18.69 26.42,27.43 30.68,31.7 31.29,31.7 32.72,33.12 35.15,33.12 36.98,31.29 39.22,31.29 40.64,32.72 51,32.72 52.43,31.29 58.73,31.29 60.35,32.92 71.32,32.92 71.53,32.72 71.93,32.31 72.14,32.11 77.01,32.11 82.5,26.62 82.5,25.2 83.11,24.59 v84.12,24.59
  Bottom 0.203: R7.1 v84.12,24.59
LED4-0  (via drill 0.51)
  Top 0.203: IC1.95 18.02,16.8 23.37,22.15 23.37,27.03 23.98,27.64 v23.98,28.04 | v22.76,36.78 32.11,36.78 37.19,31.7 39.01,31.7 40.44,33.12 51.21,33.12 52.63,31.7 58.52,31.7 60.15,33.33 62.99,33.33 v64.41,34.75
  Bottom 0.203: v23.98,28.04 23.98,29.46 23.16,30.28 23.16,36.37 v22.76,36.78 | R60.1 v64.41,34.75
LED4-2  (via drill 0.51)
  Top 0.203: IC1.93 18.41,17.8 22.96,22.35 22.96,27.23 23.16,27.43 v23.16,29.06 | v21.54,37.39 22.15,37.39 22.35,37.59 23.16,37.59 23.57,37.19 32.31,37.19 37.39,32.11 38.81,32.11 40.23,33.53 51.41,33.53 52.83,32.11 58.32,32.11 59.94,33.73 61.98,33.73 v62.99,34.75
  Bottom 0.203: v23.16,29.06 22.76,29.46 22.76,35.36 21.54,36.58 v21.54,37.39 | R61.1 v62.99,34.75
LED5-0  (via drill 0.51)
  Top 0.203: IC1.92 18.3,18.3 22.55,22.55 22.55,27.23 22.35,27.43 v22.35,28.04 | v22.76,38.41 23.16,38.41 23.98,37.59 32.11,37.59 R8.1
  Bottom 0.203: v22.35,28.04 22.35,35.15 20.73,36.78 20.73,37.8 21.13,38.2 22.55,38.2 v22.76,38.41
LED5-2  (via drill 0.51)
  Top 0.203: IC1.90 17.27,19.3 17.48,19.1 18.49,19.1 22.15,22.76 22.15,27.03 21.54,27.64 v21.54,29.06 | v21.54,39.01 22.15,39.01 22.35,39.22 23.16,39.22 24.38,38 30.48,38 R9.1
  Bottom 0.203: v21.54,29.06 21.95,29.46 21.95,34.95 20.32,36.58 20.32,38.41 20.93,39.01 v21.54,39.01
MISO  (via drill 0.51)
  Top 0.203: IC5.16 21.41,4.67 v21.95,4.67 | IC1.109 21.74,9.55 v21.34,9.14
  Bottom 0.203: ISP.1 23.98,2.64 v21.95,4.67 21.13,5.49 21.13,8.94 v21.34,9.14
MODE  (via drill 0.51)
  Top 0.203: v6.91,7.11 7.11,7.32 11.79,7.32 12.19,6.91 12.19,6.1 14.43,3.86 14.8,3.86 IC5.1 | S1.2 10.44,38.73 v10.57,38.61 10.69,38.73 S1.1
  Bottom 0.203: v6.91,7.11 5.49,8.53 2.85,8.53 1.22,10.16 1.22,35.36 1.83,35.97 5.08,35.97 7.72,38.61 v10.57,38.61
MOSI  (via drill 0.51)
  Top 0.203: IC1.111 22.74,7.3 v22.35,6.91 22.74,6.52 22.74,4.25 21.95,3.45 21.07,3.45 IC5.15
  Bottom 0.203: v22.35,6.91 25.81,6.91 ISP.4
N$1  (via drill 0.51)
  Top 0.203: IC1.17 32.54,21.3 31.9,21.95 31.9,22.35 31.5,22.76 29.06,22.76 v28.65,22.35
  Bottom 0.203: R1.2 v28.65,22.35
N$2  (via drill 0.51)
  Top 0.203: IC1.122 28.24,9.55 29.06,8.74 34.75,8.74 v34.95,8.53 34.34,7.92 34.34,3.25 34.54,3.05 35.27,3.05 Y2.1
  Bottom 0.203: C2.1 35.15,8.33 v34.95,8.53
N$4  (via drill 0.51)
  Top 0.203: IC1.121 27.74,9.44 28.85,8.33 31.29,8.33 v31.7,7.92 31.7,7.32 32.29,6.73 Y2.3
  Bottom 0.203: C3.1 32.98,6.64 v31.7,7.92
N$5
  Bottom 0.203: ETH1.11 47.57,2.82 45.31,5.08 R13.2
N$9
  Bottom 0.203: ETH3.10 89.53,22.23 88.59,23.16 R6.2
N$10
  Bottom 0.203: ETH3.11 91.06,25.22 90.42,24.59 R7.2
N$11
  Top 0.203: ETH5.10 41.73,40.16 40.64,41.25 35.76,41.25 R8.2
N$12
  Top 0.203: ETH5.11 34.16,41.68 R9.2
N$13
  Bottom 0.203: ETH2.10 62.05,4.34 62.99,5.28 R10.2
N$14
  Bottom 0.203: ETH1.10 43.16,4.34 43.89,5.08 R12.2
N$15
  Bottom 0.203: ETH2.11 66.88,2.82 64.41,5.28 R11.2
N$16  (via drill 0.51)
  Top 0.203: LED1.C 12.8,3.86 12.8,4.27 v12.39,4.67
  Bottom 0.203: R14.2 12.8,4.27 v12.39,4.67
N$17
  Top 0.203: U$1.D- 8.32,14.21 8.53,14.43 R15.2 R17.1
N$18
  Top 0.203: R16.2 8.74,13.01 8.33,13.41 U$1.D+
N$25
  Top 0.203: LED3.C R23.2
N$47  (via drill 0.51)
  Top 0.406: R24.1 4.95,30.24 R25.2 4.91,29.22 v5.08,29.06
  Bottom 0.406: IC4.1 4.95,29.18 v5.08,29.06
N$48  (via drill 0.51)
  Top 0.406: R26.1 4.95,23.33 R27.2 4.91,22.32 v5.08,22.15
  Bottom 0.406: IC3.1 4.95,22.28 v5.08,22.15
N$51
  Bottom 0.406: C29.1 42.47,23.91 R29.1 R28.1
N$53
  Bottom 0.406: R31.1 R30.1 41.05,23.91 C38.1
N$54
  Bottom 0.406: R33.1 R32.1 61.43,19.79 C39.1
N$55
  Bottom 0.406: R34.1 R35.1 56.21,14.57 C40.1
N$56
  Bottom 0.406: R37.1 R36.1 75.32,24.48 C41.1
N$57
  Bottom 0.406: R38.1 R39.1 75.32,20.02 C42.1
N$58
  Bottom 0.406: R41.1 R40.1 56.21,29.93 C43.1
N$59
  Bottom 0.406: R42.1 R43.1 61.43,24.71 C44.1
N$60
  Bottom 0.406: R44.1 R45.1 47.35,21 C45.1
N$61
  Bottom 0.406: C46.1 48.77,21 R46.1 R47.1
N$68
  Bottom 0.203: ETH4.10 65.56,40.16 64.41,39.01 R60.2
N$69
  Bottom 0.203: R61.2 62.99,40.84 62.15,41.68 ETH4.11
PS0
  Top 0.203: IC1.114 24.24,9.49 24.59,9.14 26.01,9.14 TP1.P$1
PS1
  Top 0.203: IC1.113 23.74,8.77 24.08,8.43 SJ1.1
RXM1  (via drill 0.51)
  Top 0.203: IC1.5 34.61,15.3 38.2,18.9 42.27,18.9 v42.88,18.29 42.75,18.16 ETH1.2
  Bottom 0.203: v42.88,18.29 41.05,20.12 R30.2
RXM2  (via drill 0.51)
  Top 0.203: IC1.11 34.97,18.3 37.19,20.52 54.46,20.52 v56.29,18.69 58.37,16.61 ETH2.2
  Bottom 0.203: R34.2 v56.29,18.69
RXM3  (via drill 0.51)
  Top 0.203: ETH3.2 74.7,19.18 v72.34,21.54 71.73,22.15 36.37,22.15 35.72,22.8 IC1.20
  Bottom 0.203: R38.2 v72.34,21.54
RXM4  (via drill 0.51)
  Top 0.203: IC1.26 35.56,25.8 37.59,23.77 56.29,23.77 v57.3,24.79 58.52,26.01 67.67,26.01 68.2,26.54 ETH4.2
  Bottom 0.203: R42.2 v57.3,24.79
RXM5  (via drill 0.51)
  Top 0.203: IC1.33 34.7,29.3 38.61,25.4 46.94,25.4 v47.75,26.21 47.75,26.54 ETH5.2
  Bottom 0.203: v47.75,26.21 47.75,26.01 48.77,24.99 R46.2
RXP1  (via drill 0.51)
  Top 0.203: IC1.4 34.72,14.8 38.41,18.49 41.25,18.49 v41.66,18.09 41.48,17.91 ETH1.1
  Bottom 0.203: R31.2 39.62,20.12 v41.66,18.09
RXP2  (via drill 0.51)
  Top 0.203: IC1.10 35.08,17.8 37.39,20.12 52.83,20.12 v55.27,17.68 58.88,14.07 ETH2.1
  Bottom 0.203: R35.2 v55.27,17.68
RXP3  (via drill 0.51)
  Top 0.203: ETH3.1 74.55,17.91 v72.34,20.12 70.71,21.74 36.17,21.74 35.61,22.3 IC1.19
  Bottom 0.203: R39.2 v72.34,20.12
RXP4  (via drill 0.51)
  Top 0.203: IC1.25 35.45,25.3 37.39,23.37 57.91,23.37 v58.32,23.77 60.15,25.6 67.87,25.6 69.47,27.2 ETH4.1
  Bottom 0.203: R43.2 v58.32,23.77
RXP5  (via drill 0.51)
  Top 0.203: IC1.32 34.59,28.8 38.41,24.99 47.75,24.99 v48.97,26.21 50.37,27.61 ETH5.1
  Bottom 0.203: v48.97,26.21 50.19,24.99 R47.2
SCK  (via drill 0.51)
  Top 0.203: IC1.110 22.24,8.43 v21.95,8.13 21.54,7.72 21.54,5.65 IC5.17
  Bottom 0.203: v21.95,8.13 21.54,7.72 21.54,5.89 21.95,5.49 22.55,5.49 24.18,3.86 25.81,3.86 27.03,2.64 ISP.3
SCONF0
  Top 0.203: IC1.87 14.51,20.8 TP2.P$1
SCONF1
  Top 0.203: IC1.86 14.46,21.3 TP3.P$1
STATUS
  Top 0.203: LED1.A 14.16,2.52 IC5.2
SW-RESET  (via drill 0.51)
  Top 0.203: v24.59,12.8 24.74,12.64 IC1.115 | v20.12,9.35 19.51,9.35 19.1,8.94 19.1,8.16 IC5.24
  Bottom 0.203: v20.12,9.35 23.57,12.8 v24.59,12.8
TXM1  (via drill 0.51)
  Top 0.203: IC1.8 34.69,16.8 37.59,19.71 43.89,19.71 v45.31,18.29 46.99,16.61 ETH1.6
  Bottom 0.203: v45.31,18.29 45.31,18.49 43.89,19.91 R28.2
TXM2  (via drill 0.51)
  Top 0.203: IC1.14 35.05,19.8 36.58,21.34 57.71,21.34 v58.32,20.73 60.76,18.29 65.25,18.29 ETH2.6
  Bottom 0.203: R32.2 v58.32,20.73
TXM3  (via drill 0.51)
  Top 0.203: ETH3.6 72.47,24.26 v72.34,24.38 70.92,22.96 36.78,22.96 35.44,24.3 IC1.23
  Bottom 0.203: R36.2 v72.34,24.38
TXM4  (via drill 0.51)
  Top 0.203: IC1.29 35.28,27.3 38,24.59 53.03,24.59 v55.27,26.82 62.05,26.82 ETH4.6
  Bottom 0.203: R40.2 v55.27,26.82 | v55.27,26.82
TXM5  (via drill 0.51)
  Top 0.203: IC1.36 34.62,30.8 39.22,26.21 44.91,26.21 v45.31,26.62 44.04,27.89 ETH5.6
  Bottom 0.203: v45.31,26.62 45.31,25.81 45.92,25.2 R44.2
TXP1  (via drill 0.51)
  Top 0.203: IC1.7 34.8,16.3 37.8,19.3 43.08,19.3 v44.09,18.29 44.02,18.21 ETH1.3
  Bottom 0.203: v44.09,18.29 44.09,18.49 42.47,20.12 R29.2
TXP2  (via drill 0.51)
  Top 0.203: IC1.13 35.16,19.3 36.78,20.93 56.08,20.93 v57.3,19.71 59.13,17.88 62.38,17.88 63.12,17.14 ETH2.3
  Bottom 0.203: R33.2 v57.3,19.71
TXP3  (via drill 0.51)
  Top 0.203: ETH3.3 74.85,20.45 v72.34,22.96 71.93,22.55 36.58,22.55 35.33,23.8 IC1.22
  Bottom 0.203: R37.2 v72.34,22.96
TXP4  (via drill 0.51)
  Top 0.203: IC1.28 35.17,26.8 37.8,24.18 54.66,24.18 v56.29,25.81 56.9,26.42 66.24,26.42 66.93,27.1 ETH4.3
  Bottom 0.203: R41.2 v56.29,25.81
TXP5  (via drill 0.51)
  Top 0.203: IC1.35 34.52,30.3 39.01,25.81 46.13,25.81 v46.53,26.21 47.83,27.51 ETH5.3
  Bottom 0.203: v46.53,26.21 46.53,25.81 47.35,24.99 R45.2
UC-RESET  (via drill 0.51)
  Top 0.203: v18.09,8.53 17.48,8.53 15.85,6.91 15.85,6.55 IC5.29
  Bottom 0.203: ISP.5 30.07,2.03 29.26,1.22 24.18,1.22 20.73,4.67 20.73,8.13 20.32,8.53 v18.09,8.53
V_USB  (via drill 0.51)
  Top 0.61: U$1.VBUS 6.97,15.59 6.71,15.85 5.89,15.85 4.47,17.27 4.47,17.88 1.42,20.93 1.42,26.28 1.9,26.76 | 1.9,26.76 C22.1 4.81,26.76 v4.88,26.82 | 1.9,26.76 1.42,27.23 1.42,33.12 1.97,33.66 C24.1 4.81,33.66 v4.88,33.73
  Bottom 0.61: IC3.3 4.8,26.9 v4.88,26.82 | IC4.3 4.8,33.81 v4.88,33.73
XTAL1  (via drill 0.51)
  Top 0.203: Y1.1 8.81,4.4 v9.14,4.06 9.55,4.47 11.18,4.47 11.99,3.66 11.99,2.64 13.01,1.63 16.8,1.63 IC5.7
  Bottom 0.203: C23.1 8.53,4.67 v9.14,4.06
XTAL2  (via drill 0.51)
  Top 0.203: v10.77,3.66 11.11,3.32 Y1.3 11.81,2.21 12.8,1.22 17.11,1.22 IC5.8
  Bottom 0.203: C21.1 10.91,3.52 v10.77,3.66

### Text on the board
_tsilk: 5p-switch - rev1 - Balto